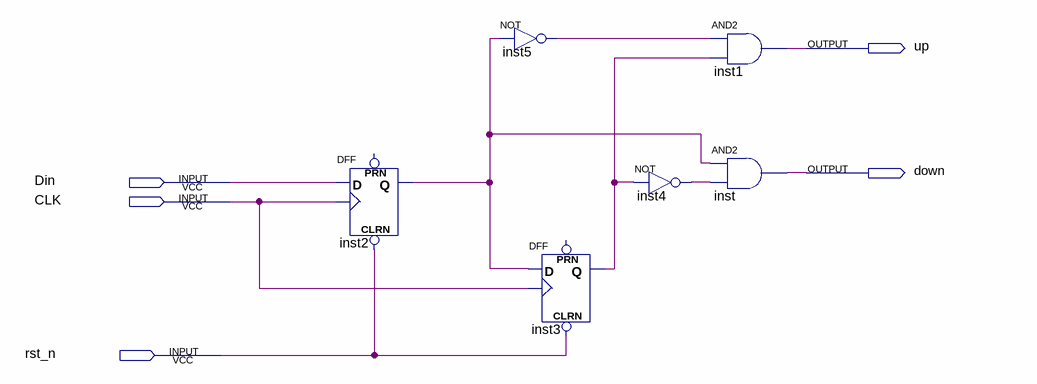
[diagram p0: schematic sheet]
// Quartus schematic ud_trigger.bdf as structural Verilog: 6 symbols, 5 pins
module ud_trigger (
  input  Din,
  input  CLK,
  input  rst_n,
  output up,
  output down
);

  wire inst2_q, inst3_q, inst4_out, inst5_out;

  DFF inst2 (.CLRN(rst_n), .CLK(CLK), .D(Din), .Q(inst2_q));  // open: PRN
  not inst5 (inst5_out, inst2_q);
  DFF inst3 (.CLRN(rst_n), .CLK(CLK), .D(inst2_q), .Q(inst3_q));  // open: PRN
  not inst4 (inst4_out, inst3_q);
  and inst1 (up, inst5_out, inst3_q);
  and inst (down, inst2_q, inst4_out);
endmodule
